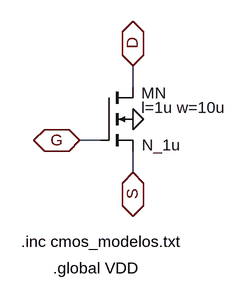
[diagram p0: schematic NMOSX.asc]
NMOSX.asc, the LTspice schematic file:
Version 4
SHEET 1 2472 680
WIRE -912 -240 -912 -272
WIRE -960 -160 -992 -160
WIRE -912 -112 -912 -144
FLAG -912 -192 0
FLAG -992 -160 G
IOPIN -992 -160 BiDir
FLAG -912 -272 D
IOPIN -912 -272 BiDir
FLAG -912 -112 S
IOPIN -912 -112 BiDir
SYMBOL nmos4 -960 -240 R0
WINDOW 0 61 9 Left 2
WINDOW 3 62 87 Left 2
WINDOW 123 61 31 Left 2
SYMATTR InstName MN
SYMATTR Value N_1u
SYMATTR Value2 l=1u w=10u
TEXT -1080 -8 Left 2 !.inc cmos_modelos.txt
TEXT -1032 32 Left 2 !.global VDD

The netlist it stands for:
* NMOSX.asc
MN D G S 0 N_1u l=1u w=10u
.model NMOS NMOS
.model PMOS PMOS
.lib standard.mos
.inc cmos_modelos.txt
.global VDD
.backanno
.end